# Altium schematic sheet cube_driver.schdoc
size 105 x 95 mm
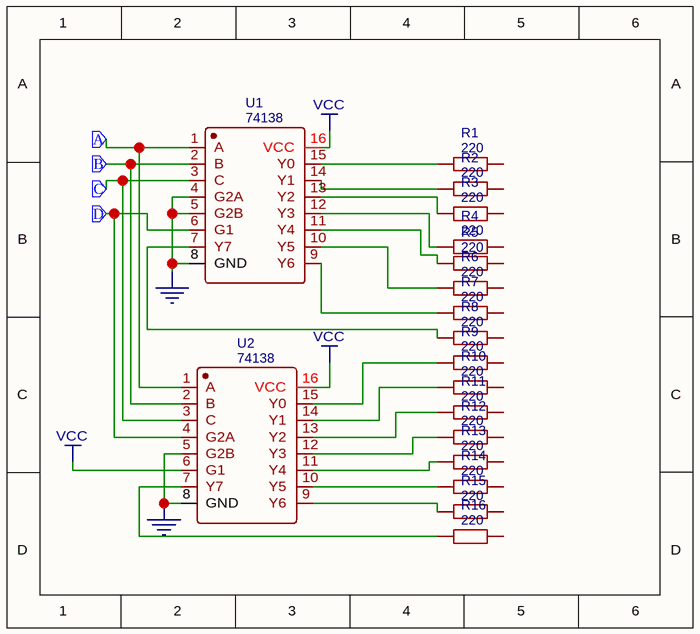
[diagram p0: cube_driver.schdoc]

## Parts
R1  220  [2512]
R2  220  [2512]
R3  220  [2512]
R4  220  [2512]
R5  220  [2512]
R6  220  [2512]
R7  220  [2512]
R8  220  [2512]
R9  220  [2512]
R10  220  [2512]
R11  220  [2512]
R12  220  [2512]
R13  220  [2512]
R14  220  [2512]
R15  220  [2512]
R16  220  [2512]
U1  74138  [DIP16]
U2  74138  [DIP16]

## Ports
A, B, C, D

## Nets
GND: U1.4(G2A) U1.5(G2B) U1.6(G1) U1.8(GND) U2.4(G2A) U2.5(G2B) U2.8(GND) ; port D
VCC: U1.16(VCC) U2.6(G1) U2.16(VCC)
A: U1.1(A) U2.1(A) ; port A
B: U1.2(B) U2.2(B) ; port B
C: U1.3(C) U2.3(C) ; port C
NetR1_1: R1.1 U1.15(Y0)
NetR2_1: R2.1 U1.14(Y1)
NetR3_1: R3.1 U1.13(Y2)
NetR4_1: R4.1 U1.12(Y3)
NetR5_1: R5.1 U1.11(Y4)
NetR6_1: R6.1 U1.10(Y5)
NetR7_1: R7.1 U1.9(Y6)
NetR8_1: R8.1 U1.7(Y7)
NetR9_1: R9.1 U2.15(Y0)
NetR10_1: R10.1 U2.14(Y1)
NetR11_1: R11.1 U2.13(Y2)
NetR12_1: R12.1 U2.12(Y3)
NetR13_1: R13.1 U2.11(Y4)
NetR14_1: R14.1 U2.10(Y5)
NetR15_1: R15.1 U2.9(Y6)
NetR16_1: R16.1 U2.7(Y7)

Not connected (* = marked no-connect by the designer): R1 2; R2 2; R3 2; R4 2; R5 2; R6 2; R7 2; R8 2; R9 2; R10 2; R11 2; R12 2; R13 2; R14 2; R15 2; R16 2

## Library data of the parts
R1-R16 = (no symbol name): nameAlias: Value(Ω); BOM_Manufacturer Part: ?; spicePre: R; spiceSymbolName: Resistor
U1 U2 = (no symbol name): spicePre: X; BOM_Manufacturer Part: ?